# Altium schematic sheet mv_cct.SchDoc
size A4
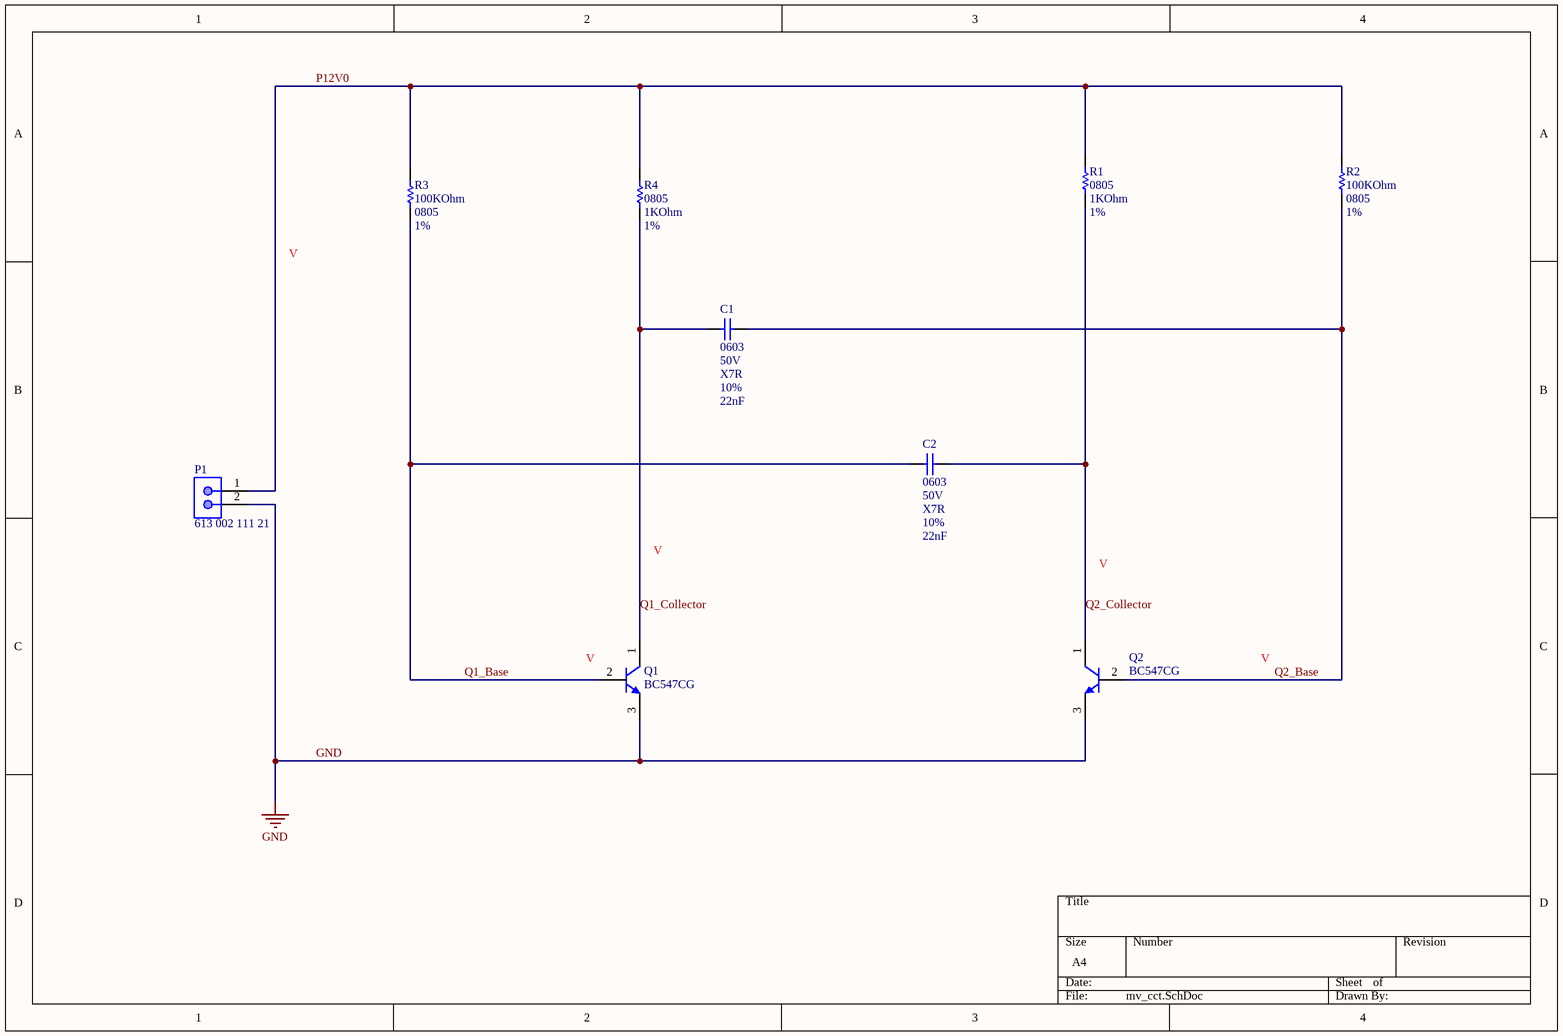
[diagram p0: mv_cct.SchDoc]

## Parts
C1  Case Code (Imperial): 0603  Voltage Rating (DC): 50V  Dielectric: X7R  Tolerance: 10%  Capacitance: 22nF  [CAPC1608X90X40ML10T20]  (hidden comment: CC0603KRX7R9BB223)
C2  Case Code (Imperial): 0603  Voltage Rating (DC): 50V  Dielectric: X7R  Tolerance: 10%  Capacitance: 22nF  [CAPC1608X90X40ML10T20]  (hidden comment: CC0603KRX7R9BB223)
P1  613 002 111 21  [WE-61300211121_V]
Q1  BC547CG  [ONSC-TO-92-3-29-11]
Q2  BC547CG  [ONSC-TO-92-3-29-11]
R1  Case/Package: 0805  Resistance: 1KOhm  Tolerance: 1%  [RESC2013X60X35ML10T20]  (hidden comment: RC0805FR-071KL)
R2  Resistance: 100KOhm  Case/Package: 0805  Tolerance: 1%  [RESC2013X60X35ML10T20]  (hidden comment: RC0805FR-07100KL)
R3  Resistance: 100KOhm  Case/Package: 0805  Tolerance: 1%  [RESC2013X60X35ML10T20]  (hidden comment: RC0805FR-07100KL)
R4  Case/Package: 0805  Resistance: 1KOhm  Tolerance: 1%  [RESC2013X60X35ML10T20]  (hidden comment: RC0805FR-071KL)

## Nets
GND: P1.2 Q1.3(E) Q2.3(E)
P12V0: P1.1 R1.2 R2.2 R3.2 R4.2
Q1_Base: C2.1 Q1.2(B) R3.1
Q1_Collector: C1.1 Q1.1(C) R4.1
Q2_Base: C1.2 Q2.2(B) R2.1
Q2_Collector: C2.2 Q2.1(C) R1.1

## Library data of the parts
C1 C2 = CMP-2100-03602-1: Chip Capacitor, 22 nF, +/- 10%, 50 V, -55 to 125 degC, 0603 (1608 Metric), RoHS, Tape and Reel; Manufacturer: Yageo; Insulation Resistance: 100GR; Dielectric Material: Ceramic; Value: 22nF; REACH SVHC: NoSVHC; Datasheet Version: Rev. 15, 10/2016; Manufacturer URL: http://www.yageo.com/; Lead Free: LeadFree; Package Description: 2-Pin Surface Mount Device, Body 1.6 x 0.8 mm; Packaging: TapeandReel; RoHSCompliant: True; Depth: 0.8mm; Package Reference: 0603; Width: 0.031inch; Package Quantity: 1; Number of Pins: 2; Voltage Rating: 50V; Datasheet URL: http://www.yageo.com/documents/recent/UPY-GPHC_X7R_6.3V-to-50V_15.pdf; Min Operating Temperature: -55degC; Max Operating Temperature: 125degC; Height: 0.8mm; Thickness: 0.035inch; Case Code (Metric): 1608; Radiation Hardening: No; Termination: SMD/SMT; Composition: Ceramic; Length: 1.6mm; Case/Package: 0603; Mount: SurfaceMount
P1 = CMP-1712-00002-3: Male Header, Pitch 2.54 mm, 1 x 2 Position, Height 8.54 mm, Tail Length 3 mm, -40 to 105 degC, RoHS, Bulk; Mounting Technology: Through Hole; Packaging: Bulk; Pins: 2; REACH SVHC: No SVHC; PartNumber: 613 002 111 21; PackageDescription: Male Header, Pitch 2.54 mm, 1 x 2 Position, Height 8.54 mm, Tail Length 3 mm; ComponentLink1Description: Manufacturer URL; Max Operating Temperature: 125 degC; ComponentLink1URL: https://www.we-online.com/; ComponentLink2Description: Datasheet; Mount: Through Hole; DatasheetVersion: Rev. J; Min Operating Temperature: -40 degC; ComponentLink2URL: http://katalog.we-online.de/em/datasheet/6130xx11121.pdf; RoHSCompliant: True
Q1 Q2 = CMP-1048-01464-1: Amplifier Transistor, NPN Silicon, 3-Pin TO-92, Pb-Free, Bulk Box; Manufacturer: On Semiconductor; fT Min (MHz): 150; IC Continuous (A): 0.1; ComponentLink1URL: http://www.onsemi.com/; ComponentLink3URL: http://www.onsemi.cn/pub_link/Collateral/2N6426-D.PDF; RoHS: TRUE; ComponentLink2Description: Datasheet; PartNumber: BC547CG; Polarity: NPN; DatasheetVersion: Rev. 7; PackageReference: TO-92-3-29-11_AM_SL; PackageDescription: 3-Pin Transistor Outline, Body 4.825 x 3.685 mm, Pitch 1.27 mm; ComponentLink3Description: Package Specification; ComponentLink1Description: Manufacturer URL; Packing: Bulk Box; PackageVersion: Rev. AM; Mounting Technology: Through Hole; ComponentLink2URL: http://www.onsemi.com/pub_link/Collateral/BC546-D.PDF
R1 R4 = CMP-2100-03671-1: Chip Resistor, 1 KOhm, +/- 1%, 125 mW, -55 to 155 degC, 0805 (2012 Metric), RoHS, Tape and Reel; Manufacturer: Yageo; Temperature Coefficient: 100ppm/degreesC; Voltage Rating (DC): 150V; Max Power Dissipation: 125mW; Value: 1K; Number of Pins: 2; Number of Terminations: 2; Datasheet URL: http://www.yageo.com/NewPortal/yageodocoutput?fileName=/pdf/R-Chip/PYu-RC_Group_51_RoHS_L_5.pdf; Length: 0.079inch; Package Description: 2-Pin Surface Mounted Device, Body 2 x 1.25 mm; Depth: 1.25mm; Height: 0.024inch; Military Standard: Not; Package Reference: 0805; RoHSCompliant: true; Lead Free: LeadFree; Packaging: TapeandReel; Package Quantity: 1; Datasheet Version: Rev. 5, 10/2016; Min Operating Temperature: -55degC; Voltage Rating: 150V; Composition: ThickFilm; Case Code (Imperial): 0805; Power Rating: 125mW; Width: 0.049inch; Case Code (Metric): 2012; Manufacturer URL: http://www.yageo.com/; Max Operating Temperature: 155degC; REACH SVHC: Unknown; Termination: SMD/SMT
R2 R3 = CMP-2100-03668-1: Chip Resistor, 100 KOhm, +/- 1%, 0.125 W, -55 to 155 degC, 0805 (2012 Metric), RoHS, Tape and Reel; Manufacturer: Yageo; Max Power Dissipation: 125mW; Voltage Rating: 150V; Temperature Coefficient: 100ppm/degreesC; Value: 10K; Manufacturer URL: http://www.yageo.com/; Min Operating Temperature: -55degC; Lead Pitch: 0.4mm; Composition: ThickFilm; Case Code (Metric): 2012; Military Standard: Not; Package Description: 2-Pin Surface Mounted Device, Body 2 x 1.25 mm; REACH SVHC: Unknown; RoHSCompliant: true; Depth: 1.25mm; Number of Pins: 2; Lead Free: LeadFree; Datasheet URL: http://www.yageo.com/NewPortal/yageodocoutput?fileName=/pdf/R-Chip/PYu-RC_Group_51_RoHS_L_5.pdf; Max Operating Temperature: 155degC; Package Quantity: 1; Case Code (Imperial): 0805; Power Rating: 125mW; Width: 0.049inch; Package Reference: 0805; Height: 0.024inch; Termination: SMD/SMT; Datasheet Version: Rev. 5, 10/2016; Length: 2mm; Voltage Rating (DC): 150V; Number of Terminations: 2; Packaging: TapeandReel